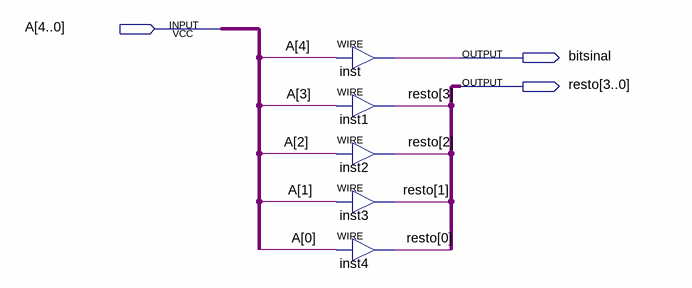
[diagram p0: schematic sheet]
// Quartus schematic separacomp.bdf as structural Verilog: 5 symbols, 3 pins
module separacomp (
  input  [4:0] A,
  output bitsinal,
  output [3:0] resto
);

  assign bitsinal = A[4];  // WIRE inst
  assign resto[3] = A[3];  // WIRE inst1
  assign resto[2] = A[2];  // WIRE inst2
  assign resto[1] = A[1];  // WIRE inst3
  assign resto[0] = A[0];  // WIRE inst4
endmodule
